# EAGLE schematic spu-schematic (EAGLE 9.6.2)
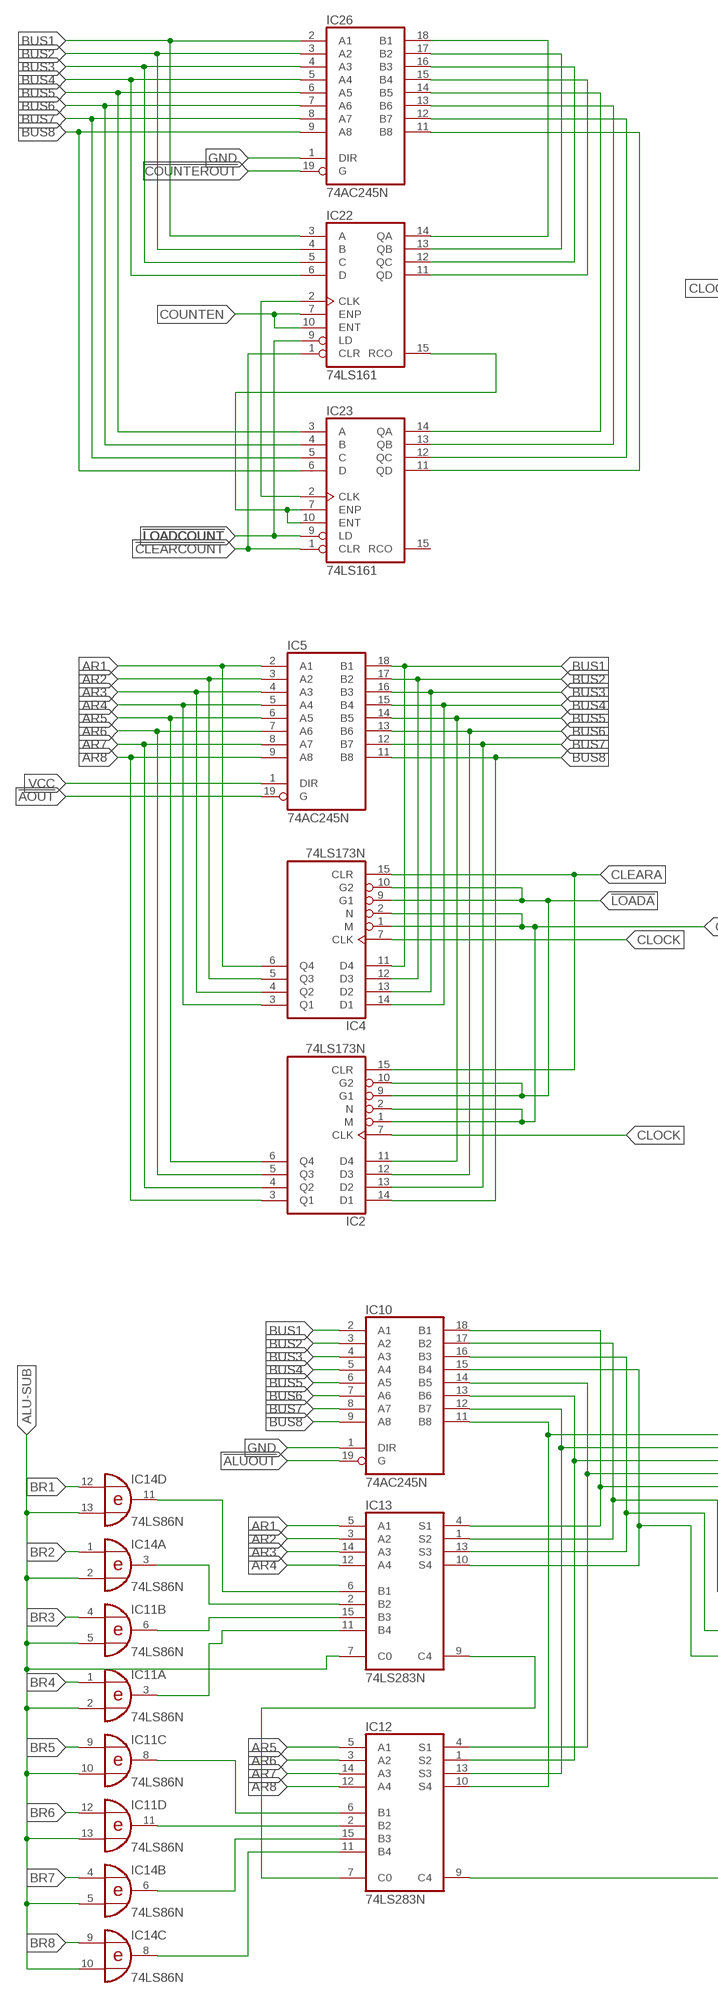
[diagram p0: schematic, sheet 1, part 1 of 2]
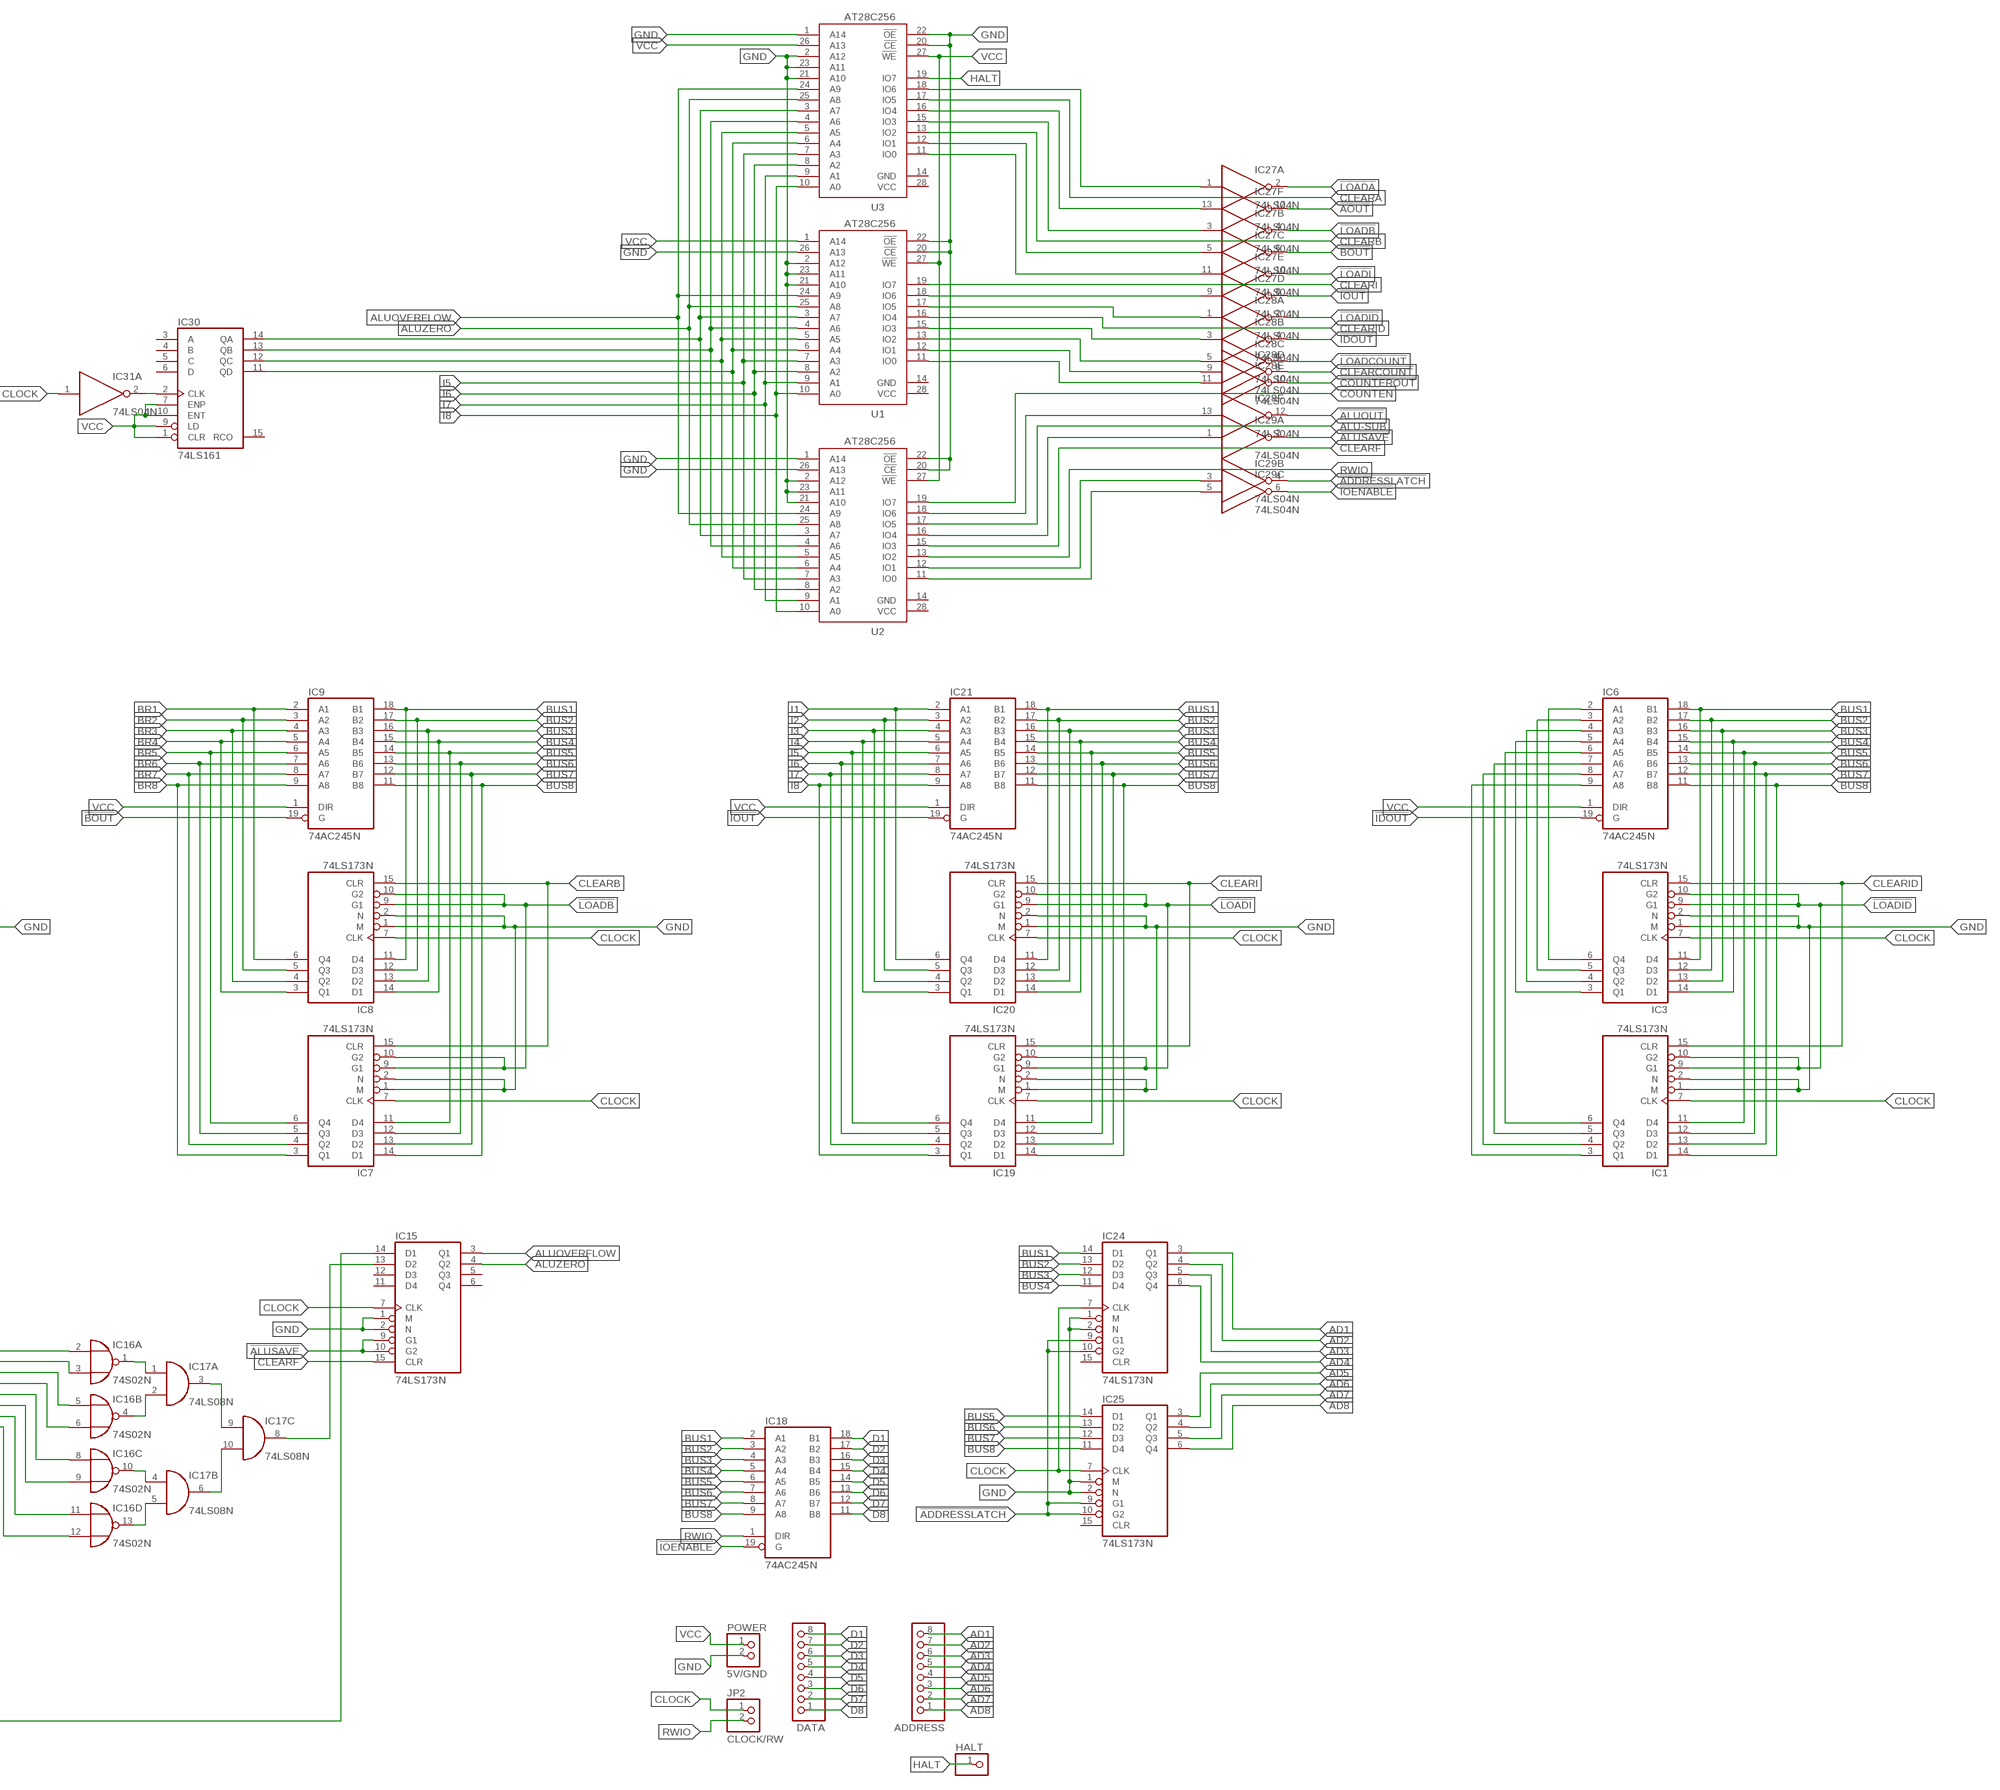
[diagram p1: schematic, sheet 1, part 2 of 2]

## Parts
ADDRESS  PINHD-1X8  [1X08]
DATA  PINHD-1X8  [1X08]
HALT  PINHD-1X1  [1X01]
IC1  74LS173N  [DIL16]
IC2  74LS173N  [DIL16]
IC3  74LS173N  [DIL16]
IC4  74LS173N  [DIL16]
IC5  74AC245N  [DIL20]
IC6  74AC245N  [DIL20]
IC7  74LS173N  [DIL16]
IC8  74LS173N  [DIL16]
IC9  74AC245N  [DIL20]
IC10  74AC245N  [DIL20]
IC11  74LS86N  [DIL14]
IC12  74LS283N  [DIL16]
IC13  74LS283N  [DIL16]
IC14  74LS86N  [DIL14]
IC15  74LS173N  [DIL16]
IC16  74S02N  [DIL14]
IC17  74LS08N  [DIL14]
IC18  74AC245N  [DIL20]
IC19  74LS173N  [DIL16]
IC20  74LS173N  [DIL16]
IC21  74AC245N  [DIL20]
IC22  74LS161  74HCT160N  [DIL16]
IC23  74LS161  74HCT160N  [DIL16]
IC24  74LS173N  [DIL16]
IC25  74LS173N  [DIL16]
IC26  74AC245N  [DIL20]
IC27  74LS04N  [DIL14]
IC28  74LS04N  [DIL14]
IC29  74LS04N  [DIL14]
IC30  74LS161  74HC160N  [DIL16]
IC31  74LS04N  [DIL14]
JP2  CLOCK/RW  PINHD-1X2  [1X02]
POWER  5V/GND  PINHD-1X2  [1X02]
U1  AT28C256  [DIL28-6]
U2  AT28C256  [DIL28-6]
U3  AT28C256  [DIL28-6]

## Nets
!ADDRESSLATCH: IC24.9(G1) IC24.10(G2) IC25.9(G1) IC25.10(G2) IC29.4(B:O)
!ALUOUT: IC10.19(G) IC28.12(F:O)
!ALUSAVE: IC15.9(G1) IC15.10(G2) IC29.2(A:O)
!AOUT: IC5.19(G) IC27.12(F:O)
!BOUT: IC9.19(G) IC27.6(C:O)
!CLEARCOUNT: IC22.1(CLR) IC23.1(CLR) IC28.8(D:O)
!COUNTEROUT: IC26.19(G) IC28.10(E:O)
!IDOUT: IC6.19(G) IC28.4(B:O)
!IOENABLE: IC18.19(G) IC29.6(C:O)
!IOUT: IC21.19(G) IC27.8(D:O)
!LOADA: IC2.9(G1) IC2.10(G2) IC4.9(G1) IC4.10(G2) IC27.2(A:O)
!LOADB: IC7.9(G1) IC7.10(G2) IC8.9(G1) IC8.10(G2) IC27.4(B:O)
!LOADCOUNT: IC22.9(LD) IC23.9(LD) IC28.6(C:O)
!LOADI: IC19.9(G1) IC19.10(G2) IC20.9(G1) IC20.10(G2) IC27.10(E:O)
!LOADID: IC1.9(G1) IC1.10(G2) IC3.9(G1) IC3.10(G2) IC28.2(A:O)
AD1: ADDRESS.8 IC24.3(Q1)
AD2: ADDRESS.7 IC24.4(Q2)
AD3: ADDRESS.6 IC24.5(Q3)
AD4: ADDRESS.5 IC24.6(Q4)
AD5: ADDRESS.4 IC25.3(Q1)
AD6: ADDRESS.3 IC25.4(Q2)
AD7: ADDRESS.2 IC25.5(Q3)
AD8: ADDRESS.1 IC25.6(Q4)
ALU-SUB: IC11.2(A:I1) IC11.5(B:I1) IC11.10(C:I1) IC11.13(D:I1) IC13.7(C0) IC14.2(A:I1) IC14.5(B:I1) IC14.10(C:I1) IC14.13(D:I1) U2.17(IO5)
ALUOVERFLOW: IC15.3(Q1) U1.24(A9) U2.24(A9) U3.24(A9)
ALUZERO: IC15.4(Q2) U1.25(A8) U2.25(A8) U3.25(A8)
AR1: IC4.6(Q4) IC5.2(A1) IC13.5(A1)
AR2: IC4.5(Q3) IC5.3(A2) IC13.3(A2)
AR3: IC4.4(Q2) IC5.4(A3) IC13.14(A3)
AR4: IC4.3(Q1) IC5.5(A4) IC13.12(A4)
AR5: IC2.6(Q4) IC5.6(A5) IC12.5(A1)
AR6: IC2.5(Q3) IC5.7(A6) IC12.3(A2)
AR7: IC2.4(Q2) IC5.8(A7) IC12.14(A3)
AR8: IC2.3(Q1) IC5.9(A8) IC12.12(A4)
BR1: IC8.6(Q4) IC9.2(A1) IC14.12(D:I0)
BR2: IC8.5(Q3) IC9.3(A2) IC14.1(A:I0)
BR3: IC8.4(Q2) IC9.4(A3) IC11.4(B:I0)
BR4: IC8.3(Q1) IC9.5(A4) IC11.1(A:I0)
BR5: IC7.6(Q4) IC9.6(A5) IC11.9(C:I0)
BR6: IC7.5(Q3) IC9.7(A6) IC11.12(D:I0)
BR7: IC7.4(Q2) IC9.8(A7) IC14.4(B:I0)
BR8: IC7.3(Q1) IC9.9(A8) IC14.9(C:I0)
BR9: IC3.6(Q4) IC6.2(A1)
BR10: IC3.5(Q3) IC6.3(A2)
BR11: IC3.4(Q2) IC6.4(A3)
BR12: IC3.3(Q1) IC6.5(A4)
BR13: IC1.5(Q3) IC6.7(A6)
BR14: IC1.6(Q4) IC6.6(A5)
BR15: IC1.4(Q2) IC6.8(A7)
BR16: IC1.3(Q1) IC6.9(A8)
BUS1: IC3.11(D4) IC4.11(D4) IC5.18(B1) IC6.18(B1) IC8.11(D4) IC9.18(B1) IC10.2(A1) IC18.2(A1) IC20.11(D4) IC21.18(B1) IC22.3(A) IC24.14(D1) IC26.2(A1)
BUS2: IC3.12(D3) IC4.12(D3) IC5.17(B2) IC6.17(B2) IC8.12(D3) IC9.17(B2) IC10.3(A2) IC18.3(A2) IC20.12(D3) IC21.17(B2) IC22.4(B) IC24.13(D2) IC26.3(A2)
BUS3: IC3.13(D2) IC4.13(D2) IC5.16(B3) IC6.16(B3) IC8.13(D2) IC9.16(B3) IC10.4(A3) IC18.4(A3) IC20.13(D2) IC21.16(B3) IC22.5(C) IC24.12(D3) IC26.4(A3)
BUS4: IC3.14(D1) IC4.14(D1) IC5.15(B4) IC6.15(B4) IC8.14(D1) IC9.15(B4) IC10.5(A4) IC18.5(A4) IC20.14(D1) IC21.15(B4) IC22.6(D) IC24.11(D4) IC26.5(A4)
BUS5: IC1.11(D4) IC2.11(D4) IC5.14(B5) IC6.14(B5) IC7.11(D4) IC9.14(B5) IC10.6(A5) IC18.6(A5) IC19.11(D4) IC21.14(B5) IC23.3(A) IC25.14(D1) IC26.6(A5)
BUS6: IC1.12(D3) IC2.12(D3) IC5.13(B6) IC6.13(B6) IC7.12(D3) IC9.13(B6) IC10.7(A6) IC18.7(A6) IC19.12(D3) IC21.13(B6) IC23.4(B) IC25.13(D2) IC26.7(A6)
BUS7: IC1.13(D2) IC2.13(D2) IC5.12(B7) IC6.12(B7) IC7.13(D2) IC9.12(B7) IC10.8(A7) IC18.8(A7) IC19.13(D2) IC21.12(B7) IC23.5(C) IC25.12(D3) IC26.8(A7)
BUS8: IC1.14(D1) IC2.14(D1) IC5.11(B8) IC6.11(B8) IC7.14(D1) IC9.11(B8) IC10.9(A8) IC18.9(A8) IC19.14(D1) IC21.11(B8) IC23.6(D) IC25.11(D4) IC26.9(A8)
CLEARA: IC2.15(CLR) IC4.15(CLR) U3.17(IO5)
CLEARB: IC7.15(CLR) IC8.15(CLR) U3.13(IO2)
CLEARF: IC15.15(CLR) U2.15(IO3)
CLEARI: IC19.15(CLR) IC20.15(CLR) U1.19(IO7)
CLEARID: IC1.15(CLR) IC3.15(CLR) U1.16(IO4)
CLOCK: IC1.7(CLK) IC2.7(CLK) IC3.7(CLK) IC4.7(CLK) IC7.7(CLK) IC8.7(CLK) IC15.7(CLK) IC19.7(CLK) IC20.7(CLK) IC24.7(CLK) IC25.7(CLK) IC30.2(CLK) IC31.1(A:I) IC31.2(A:O) JP2.1
COUNTEN: IC22.7(ENP) IC22.10(ENT) U2.19(IO7)
D1: DATA.8 IC18.18(B1)
D2: DATA.7 IC18.17(B2)
D3: DATA.6 IC18.16(B3)
D4: DATA.5 IC18.15(B4)
D5: DATA.4 IC18.14(B5)
D6: DATA.3 IC18.13(B6)
D7: DATA.2 IC18.12(B7)
D8: DATA.1 IC18.11(B8)
GND: IC1.1(M) IC1.2(N) IC2.1(M) IC2.2(N) IC3.1(M) IC3.2(N) IC4.1(M) IC4.2(N) IC7.1(M) IC7.2(N) IC8.1(M) IC8.2(N) IC10.1(DIR) IC15.1(M) IC15.2(N) IC19.1(M) IC19.2(N) IC20.1(M) IC20.2(N) IC24.1(M) IC24.2(N) IC25.1(M) IC25.2(N) IC26.1(DIR) POWER.2 U1.2(A12) U1.20(!CE) U1.21(A10) U1.22(!OE) U1.23(A11) U1.26(A13) U2.1(A14) U2.2(A12) U2.20(!CE) U2.21(A10) U2.22(!OE) U2.23(A11) U2.26(A13) U3.1(A14) U3.2(A12) U3.20(!CE) U3.21(A10) U3.22(!OE) U3.23(A11)
HALT: HALT.1 U3.19(IO7)
I1: IC20.6(Q4) IC21.2(A1)
I2: IC20.5(Q3) IC21.3(A2)
I3: IC20.4(Q2) IC21.4(A3)
I4: IC20.3(Q1) IC21.5(A4)
I5: IC19.6(Q4) IC21.6(A5) U1.7(A3) U2.7(A3) U3.7(A3)
I6: IC19.5(Q3) IC21.7(A6) U1.8(A2) U2.8(A2) U3.8(A2)
I7: IC19.4(Q2) IC21.8(A7) U1.9(A1) U2.9(A1) U3.9(A1)
I8: IC19.3(Q1) IC21.9(A8) U1.10(A0) U2.10(A0) U3.10(A0)
N$1: IC12.7(C0) IC13.9(C4)
N$2: IC12.11(B4) IC14.8(C:O)
N$3: IC12.9(C4) IC15.14(D1)
N$4: IC10.14(B5) IC12.4(S1) IC16.6(B:I1)
N$5: IC10.13(B6) IC12.1(S2) IC16.5(B:I0)
N$6: IC13.6(B1) IC14.11(D:O)
N$7: IC13.2(B2) IC14.3(A:O)
N$8: IC11.6(B:O) IC13.15(B3)
N$9: IC11.3(A:O) IC13.11(B4)
N$10: IC10.18(B1) IC13.4(S1) IC16.8(C:I0)
N$11: IC10.17(B2) IC13.1(S2) IC16.9(C:I1)
N$12: IC10.16(B3) IC13.13(S3) IC16.11(D:I0)
N$13: IC10.15(B4) IC13.10(S4) IC16.12(D:I1)
N$14: IC10.12(B7) IC12.13(S3) IC16.3(A:I1)
N$15: IC10.11(B8) IC12.10(S4) IC16.2(A:I0)
N$16: IC16.1(A:O) IC17.1(A:I0)
N$17: IC22.15(RCO) IC23.7(ENP) IC23.10(ENT)
N$18: IC29.3(B:I) U2.12(IO1)
N$19: IC22.2(CLK) IC23.2(CLK)
N$20: IC29.5(C:I) U2.11(IO0)
N$21: IC11.8(C:O) IC12.6(B1)
N$22: IC11.11(D:O) IC12.2(B2)
N$23: IC12.15(B3) IC14.6(B:O)
N$24: IC22.14(QA) IC26.18(B1)
N$25: IC22.13(QB) IC26.17(B2)
N$26: IC16.4(B:O) IC17.2(A:I1)
N$27: IC16.10(C:O) IC17.4(B:I0)
N$28: IC16.13(D:O) IC17.5(B:I1)
N$29: IC17.3(A:O) IC17.9(C:I0)
N$30: IC17.6(B:O) IC17.10(C:I1)
N$31: IC15.13(D2) IC17.8(C:O)
N$32: IC22.12(QC) IC26.16(B3)
N$33: IC22.11(QD) IC26.15(B4)
N$34: IC23.14(QA) IC26.14(B5)
N$35: IC23.13(QB) IC26.13(B6)
N$36: IC23.12(QC) IC26.12(B7)
N$37: IC23.11(QD) IC26.11(B8)
N$38: IC29.1(A:I) U2.16(IO4)
N$39: IC28.13(F:I) U2.18(IO6)
N$40: IC28.11(E:I) U1.11(IO0)
N$41: IC28.9(D:I) U1.12(IO1)
N$42: IC28.5(C:I) U1.13(IO2)
N$43: IC28.3(B:I) U1.15(IO3)
N$44: IC28.1(A:I) U1.17(IO5)
N$45: IC27.9(D:I) U1.18(IO6)
N$46: IC27.11(E:I) U3.11(IO0)
N$47: IC27.5(C:I) U3.12(IO1)
N$48: IC27.3(B:I) U3.15(IO3)
N$49: IC27.13(F:I) U3.16(IO4)
N$50: IC27.1(A:I) U3.18(IO6)
N$51: IC30.14(QA) U1.3(A7) U2.3(A7) U3.3(A7)
N$55: IC30.13(QB) U1.4(A6) U2.4(A6) U3.4(A6)
N$56: IC30.12(QC) U1.5(A5) U2.5(A5) U3.5(A5)
N$57: IC30.11(QD) U1.6(A4) U2.6(A4) U3.6(A4)
RWIO: IC18.1(DIR) JP2.2 U2.13(IO2)
VCC: IC5.1(DIR) IC6.1(DIR) IC9.1(DIR) IC21.1(DIR) IC30.1(CLR) IC30.7(ENP) IC30.9(LD) IC30.10(ENT) POWER.1 U1.1(A14) U1.27(!WE) U2.27(!WE) U3.26(A13) U3.27(!WE)
Unconnected: IC15.5(Q3) IC15.6(Q4) IC15.11(D4) IC15.12(D3) IC17.11(D:O) IC17.12(D:I0) IC17.13(D:I1) IC23.15(RCO) IC24.15(CLR) IC25.15(CLR) IC29.8(D:O) IC29.9(D:I) IC29.10(E:O) IC29.11(E:I) IC29.12(F:O) IC29.13(F:I) IC30.3(A) IC30.4(B) IC30.5(C) IC30.6(D) IC30.15(RCO) IC31.3(B:I) IC31.4(B:O) IC31.5(C:I) IC31.6(C:O) IC31.8(D:O) IC31.9(D:I) IC31.10(E:O) IC31.11(E:I) IC31.12(F:O) IC31.13(F:I) U1.14(GND) U1.28(VCC) U2.14(GND) U2.28(VCC) U3.14(GND) U3.28(VCC)

## Power pins joined to a net without a drawn wire
GND: IC1.8(GND) IC2.8(GND) IC3.8(GND) IC4.8(GND) IC5.10(GND) IC6.10(GND) IC7.8(GND) IC8.8(GND) IC9.10(GND) IC10.10(GND) IC11.7(P:GND) IC12.8(GND) IC13.8(GND) IC14.7(P:GND) IC15.8(GND) IC16.7(P:GND) IC17.7(P:GND) IC18.10(GND) IC19.8(GND) IC20.8(GND) IC21.10(GND) IC22.8(GND) IC23.8(GND) IC24.8(GND) IC25.8(GND) IC26.10(GND) IC27.7(P:GND) IC28.7(P:GND) IC29.7(P:GND) IC30.8(GND) IC31.7(P:GND)
VCC: IC1.16(VCC) IC2.16(VCC) IC3.16(VCC) IC4.16(VCC) IC5.20(VCC) IC6.20(VCC) IC7.16(VCC) IC8.16(VCC) IC9.20(VCC) IC10.20(VCC) IC11.14(P:VCC) IC12.16(VCC) IC13.16(VCC) IC14.14(P:VCC) IC15.16(VCC) IC16.14(P:VCC) IC17.14(P:VCC) IC18.20(VCC) IC19.16(VCC) IC20.16(VCC) IC21.20(VCC) IC22.16(VCC) IC23.16(VCC) IC24.16(VCC) IC25.16(VCC) IC26.20(VCC) IC27.14(P:VCC) IC28.14(P:VCC) IC29.14(P:VCC) IC30.16(VCC) IC31.14(P:VCC)

## Library data of the parts
ADDRESS DATA = pinhead:PINHD-1X8: PIN HEADER
HALT = pinhead:PINHD-1X1: PIN HEADER
IC1-IC4 IC7 IC8 IC15 IC19 IC20 IC24 IC25 = 74xx-us:74*173: 4-bit D type REGISTER, 3-state
IC5 IC6 IC9 IC10 IC18 IC21 IC26 = 74xx-eu:74*245: Octal BUS TRANSCEIVER, 3-state
IC11 IC14 = 74xx-eu:74*86: Quad 2-input EXCLUSIVE-OR (XOR) gate
IC12 IC13 = 74xx-eu:74*283: 4-bit binary FULL ADDER, fast carry
IC16 = 74xx-eu:74*02: Quad 2-input NOR gate
IC17 = 74xx-eu:74*08: Quad 2-input AND gate
IC22 IC23 IC30 = 74xx-eu:74*160: Synchronous 4-bit COUNTER
IC27-IC29 IC31 = 74xx-eu:74*04: Hex INVERTER
JP2 POWER = pinhead:PINHD-1X2: PIN HEADER
U1-U3 = bt_memory:AT28C256: EEPROM 32Kx8 256k bit The AT28C256 is a high-performance Electrically Erasable and Programmable Read Only Memory. Its 256K of memory is organized as 32,768 words by 8 bits.